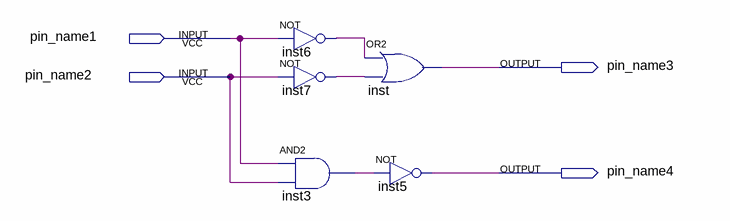
[diagram p0: schematic sheet]
// Quartus schematic morgan.bdf as structural Verilog: 5 symbols, 4 pins
module morgan (
  input  pin_name1,
  input  pin_name2,
  output pin_name3,
  output pin_name4
);

  wire inst3_out, inst6_out, inst7_out;

  not inst6 (inst6_out, pin_name1);
  not inst7 (inst7_out, pin_name2);
  and inst3 (inst3_out, pin_name1, pin_name2);
  or inst (pin_name3, inst6_out, inst7_out);
  not inst5 (pin_name4, inst3_out);
endmodule
